# EAGLE design spindle-driver (EAGLE 6.4)
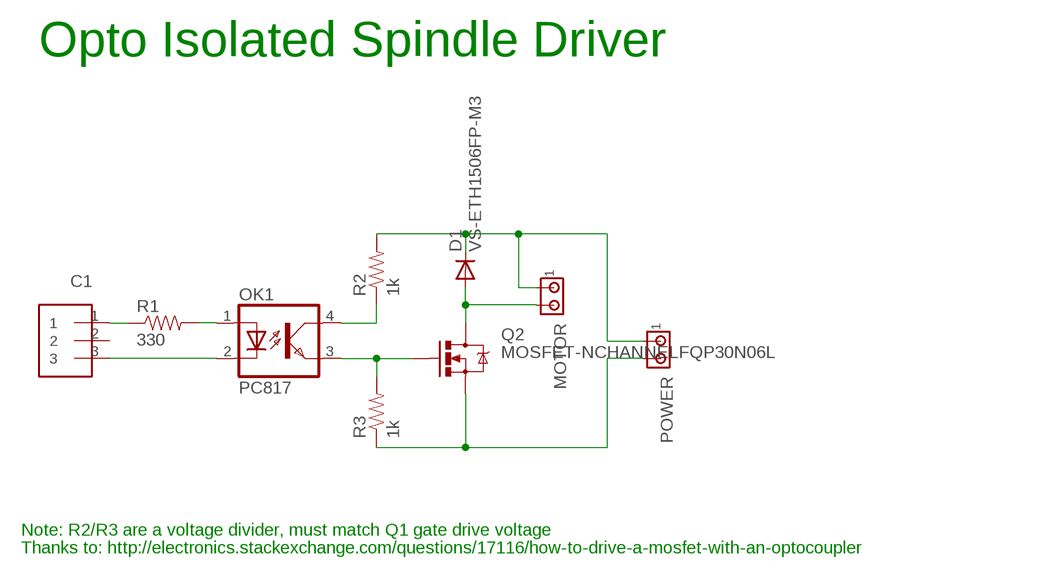
[diagram p0: schematic, sheet 1]

## Parts
C1  CONN-3XH-3  [XH-3]
D1  VS-ETH1506FP-M3  DIODE-SMB  [SMB]
MOTOR  MTA02-156  [1X2MTA]
OK1  PC817  [DIL04]
POWER  MTA02-156  [1X2MTA]
Q2  MOSFET-NCHANNELFQP30N06L  [TO220V]
R1  330  RESISTOR0805  [0805-RC]
R2  1k  RESISTOR0805  [0805-RC]
R3  1k  RESISTOR0805  [0805-RC]

## Nets
N$1 [gnd]: C1.3 OK1.2(C)
N$2: OK1.1(A) R1.2
N$3: C1.1 R1.1
N$4: D1.C MOTOR.1 POWER.1 R2.2
N$6: OK1.4(COL) R2.1
N$7: OK1.3(EMIT) Q2.1(G) R3.2
N$8: POWER.2 Q2.3(S) R3.1
N$9: D1.A MOTOR.2 Q2.2(D)
Unconnected: C1.2

## Notes on the sheet
- Opto Isolated Spindle Driver
- Note: R2/R3 are a voltage divider, must match Q1 gate drive voltage
- Thanks to: http://electronics.stackexchange.com/questions/17116/how-to-drive-a-mosfet-with-an-optocoupler

## Library data of the parts
C1 = Hoektronics:CONN-3
D1 = diode:DIODE-: DIODE
MOTOR POWER = con-amp:MTA02-156: AMP connector
OK1 = Hoektronics:PC817: SHARP OPTO COUPLER; MPN: PC817X4J000F; OC_FARNELL: 9707727; OC_NEWARK: 97K7059
Q2 = SparkFun-DiscreteSemi:MOSFET-NCHANNEL: Common NMOSFET Parts MFG P/N Store ID Prod ID FDD8780 TRANS-09984 SI7820DN TRANS-11055 FDS6630A IC-08089 2N7002PW TRANS-11151 FQP30N06L COM-10213 TRANS-10060 BSS123LT1G TRANS-08345 BSS138 TRANS-00830 BS170 2N7000; PROD_ID: TRANS-10060
R1-R3 = Hoektronics:RESISTOR: Resistor Basic schematic elements and footprints for 0603, 1206, and PTH 1/10th watt (small) resistors.

## Net classes
2 gnd: width 0.508 mm, clearance 0.254 mm

## Board
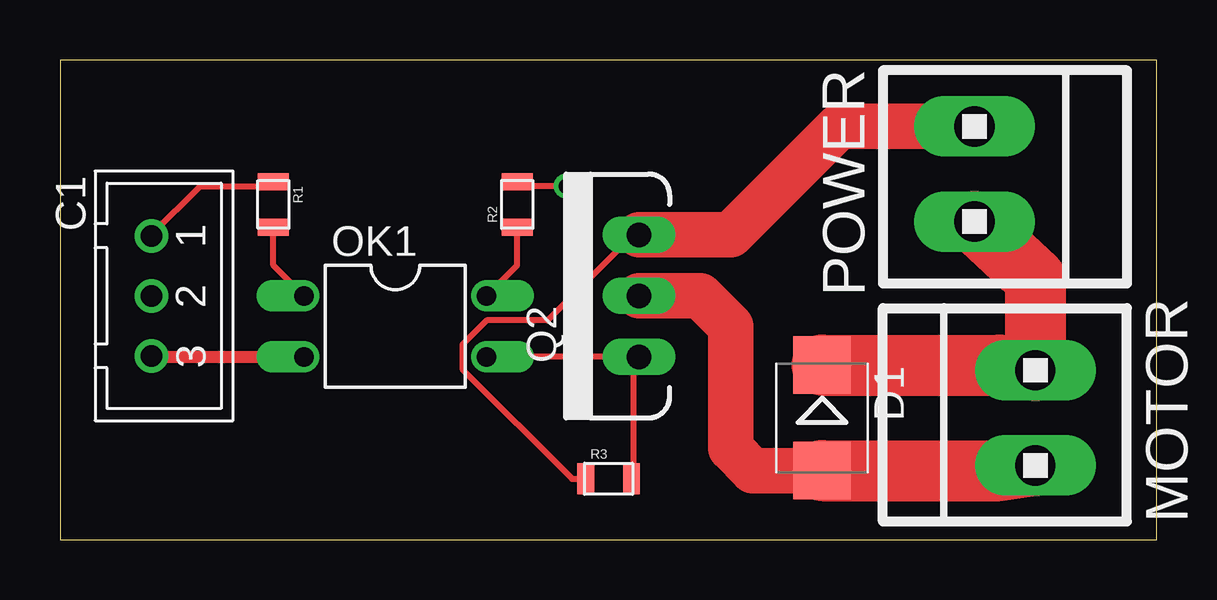
[diagram p1: board, top side]
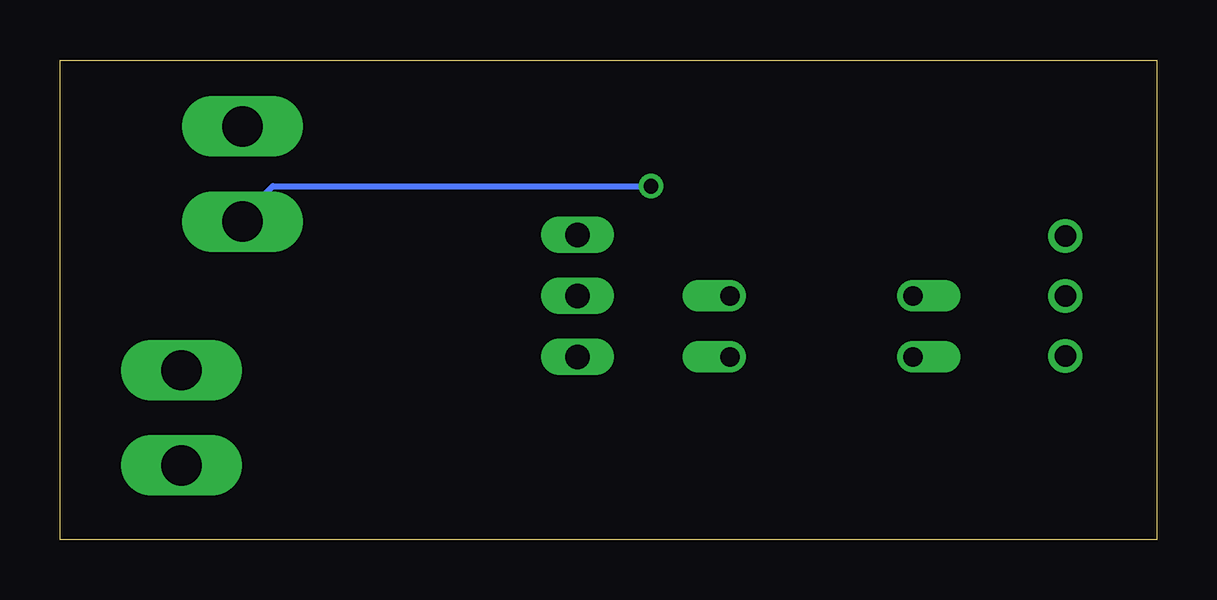
[diagram p2: board, bottom side, seen from below]

Size 45.7 x 19.99 mm. Coordinates in mm from the lower left corner, seen from the top.
Outline: 0,0 45.7,0 45.7,19.99 0,19.99 0,0
Copper layers (1*16): Top 0.035mm / dielectric 1.5mm / Bottom 0.035mm
Design rules "default": minimum track width 10mil, minimum drill 24mil, track to track 8mil, track to pad 8mil, pad to pad 8mil, via to via 8mil, smd to smd 8mil, copper to edge 40mil, drill to drill 8mil, minimum pad ring 10mil, minimum via ring 8mil, stop-mask expansion 4mil, vias tented up to drill 0mil, thermal gap 10mil

### Footprints (pad centres in the part's own frame; a part is rotated, then mirrored left to right if it is on the bottom)
XH-3 = drill 0.9: 1 -2.5,0; 2 0,0; 3 2.5,0
SMB = smd 2.4 x 2.4: A 2.2,0; C -2.2,0
1X2MTA = drill 1.676 long: 1 1.981,0; 2 -1.981,0
DIL04 = drill 0.813 offset: 1 -1.27,-3.81; 2 1.27,-3.81; 3 1.27,3.81; 4 -1.27,3.81
TO220V = drill 1.016 long: 1 -2.54,0; 2 0,0; 3 2.54,0
0805-RC = smd 0.7 x 1.3: 1 -0.95,0; 2 0.95,0

### Placement (x,y rotation side)
C1  3.81,10.16 270 top
D1  31.75,5.08 270 top
MOTOR  40.64,5.08 90 top
OK1  13.97,8.89 270 top
POWER  38.1,15.24 270 top
Q2  24.13,10.16 90 top
R1  8.89,13.97 270 top
R2  19.05,13.97 90 top
R3  22.86,2.54 0 top

### Tracks (layer width: path | path; a pad name or v marks a point on that pad's centre or on a via)
N$1
  Top 0.508: OK1.2 3.81,7.62 C1.3
N$2
  Top 0.254: R1.2 8.89,11.43 OK1.1
N$3
  Top 0.254: R1.1 8.89,14.73 5.84,14.73 3.81,12.7 C1.1
N$4  (via drill 0.61)
  Top 0.254: v21.08,14.73 19.05,14.73 R2.2
  Top 2.54: D1.C 39.15,7.28 MOTOR.1 40.64,10.87 POWER.1
  Bottom 0.254: v21.08,14.73 36.83,14.73 38.1,13.46 POWER.1
N$6
  Top 0.254: R2.1 19.05,11.43 OK1.4
N$7
  Top 0.254: R3.2 23.88,2.54 23.88,7.37 Q2.1 OK1.3
N$8
  Top 0.254: R3.1 21.34,2.54 16.76,7.11 16.76,8.13 17.78,9.14 20.32,9.14 23.37,12.19 Q2.3
  Top 1.905: Q2.3 27.94,12.7 32.46,17.22 POWER.2
N$9
  Top 1.905: D1.A 28.87,2.88 27.94,3.81 27.94,8.89 26.67,10.16 Q2.2
  Top 2.54: D1.A 39.15,2.88 MOTOR.2